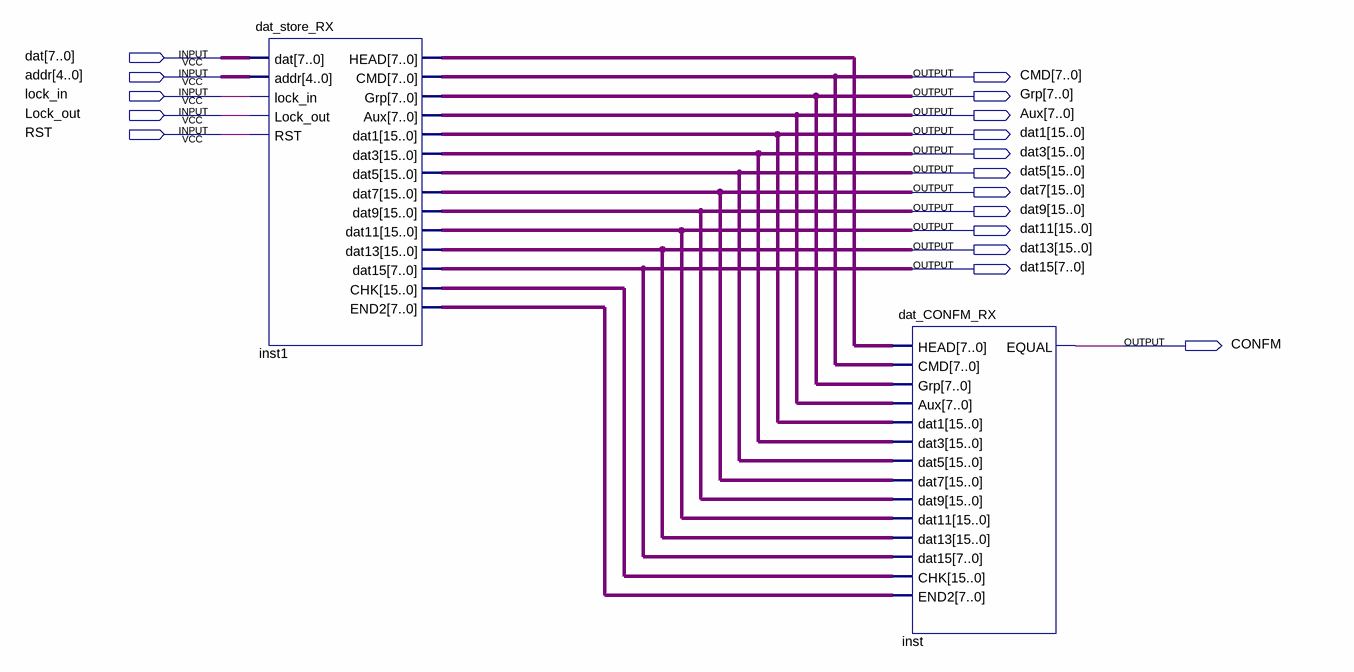
[diagram p0: schematic sheet]
// Quartus schematic RCV_DEAL.bdf as structural Verilog: 2 symbols, 17 pins
module RCV_DEAL (
  input  [7:0] dat,
  input  [4:0] addr,
  input  lock_in,
  input  Lock_out,
  input  RST,
  output [7:0] CMD,
  output [7:0] Grp,
  output [7:0] Aux,
  output [15:0] dat1,
  output [15:0] dat3,
  output [15:0] dat5,
  output [15:0] dat7,
  output [15:0] dat9,
  output [15:0] dat11,
  output [15:0] dat13,
  output [7:0] dat15,
  output CONFM
);

  wire [7:0] inst1_end2, inst1_head;
  wire [15:0] inst1_chk;

  dat_store_RX inst1 (
    .dat(dat), .addr(addr), .lock_in(lock_in), .Lock_out(Lock_out), .RST(RST), .HEAD(inst1_head), .CMD(CMD),
    .Grp(Grp), .Aux(Aux), .dat1(dat1), .dat3(dat3), .dat5(dat5), .dat7(dat7), .dat9(dat9), .dat11(dat11),
    .dat13(dat13), .dat15(dat15), .CHK(inst1_chk), .END2(inst1_end2));
  dat_CONFM_RX inst (
    .HEAD(inst1_head), .CMD(CMD), .Grp(Grp), .Aux(Aux), .dat1(dat1), .dat3(dat3), .dat5(dat5), .dat7(dat7),
    .dat9(dat9), .dat11(dat11), .dat13(dat13), .dat15(dat15), .CHK(inst1_chk), .END2(inst1_end2),
    .EQUAL(CONFM));
endmodule
